# Altium schematic sheet PDB_v1.SchDoc
size 260 x 327 mm; Origin: Eagle
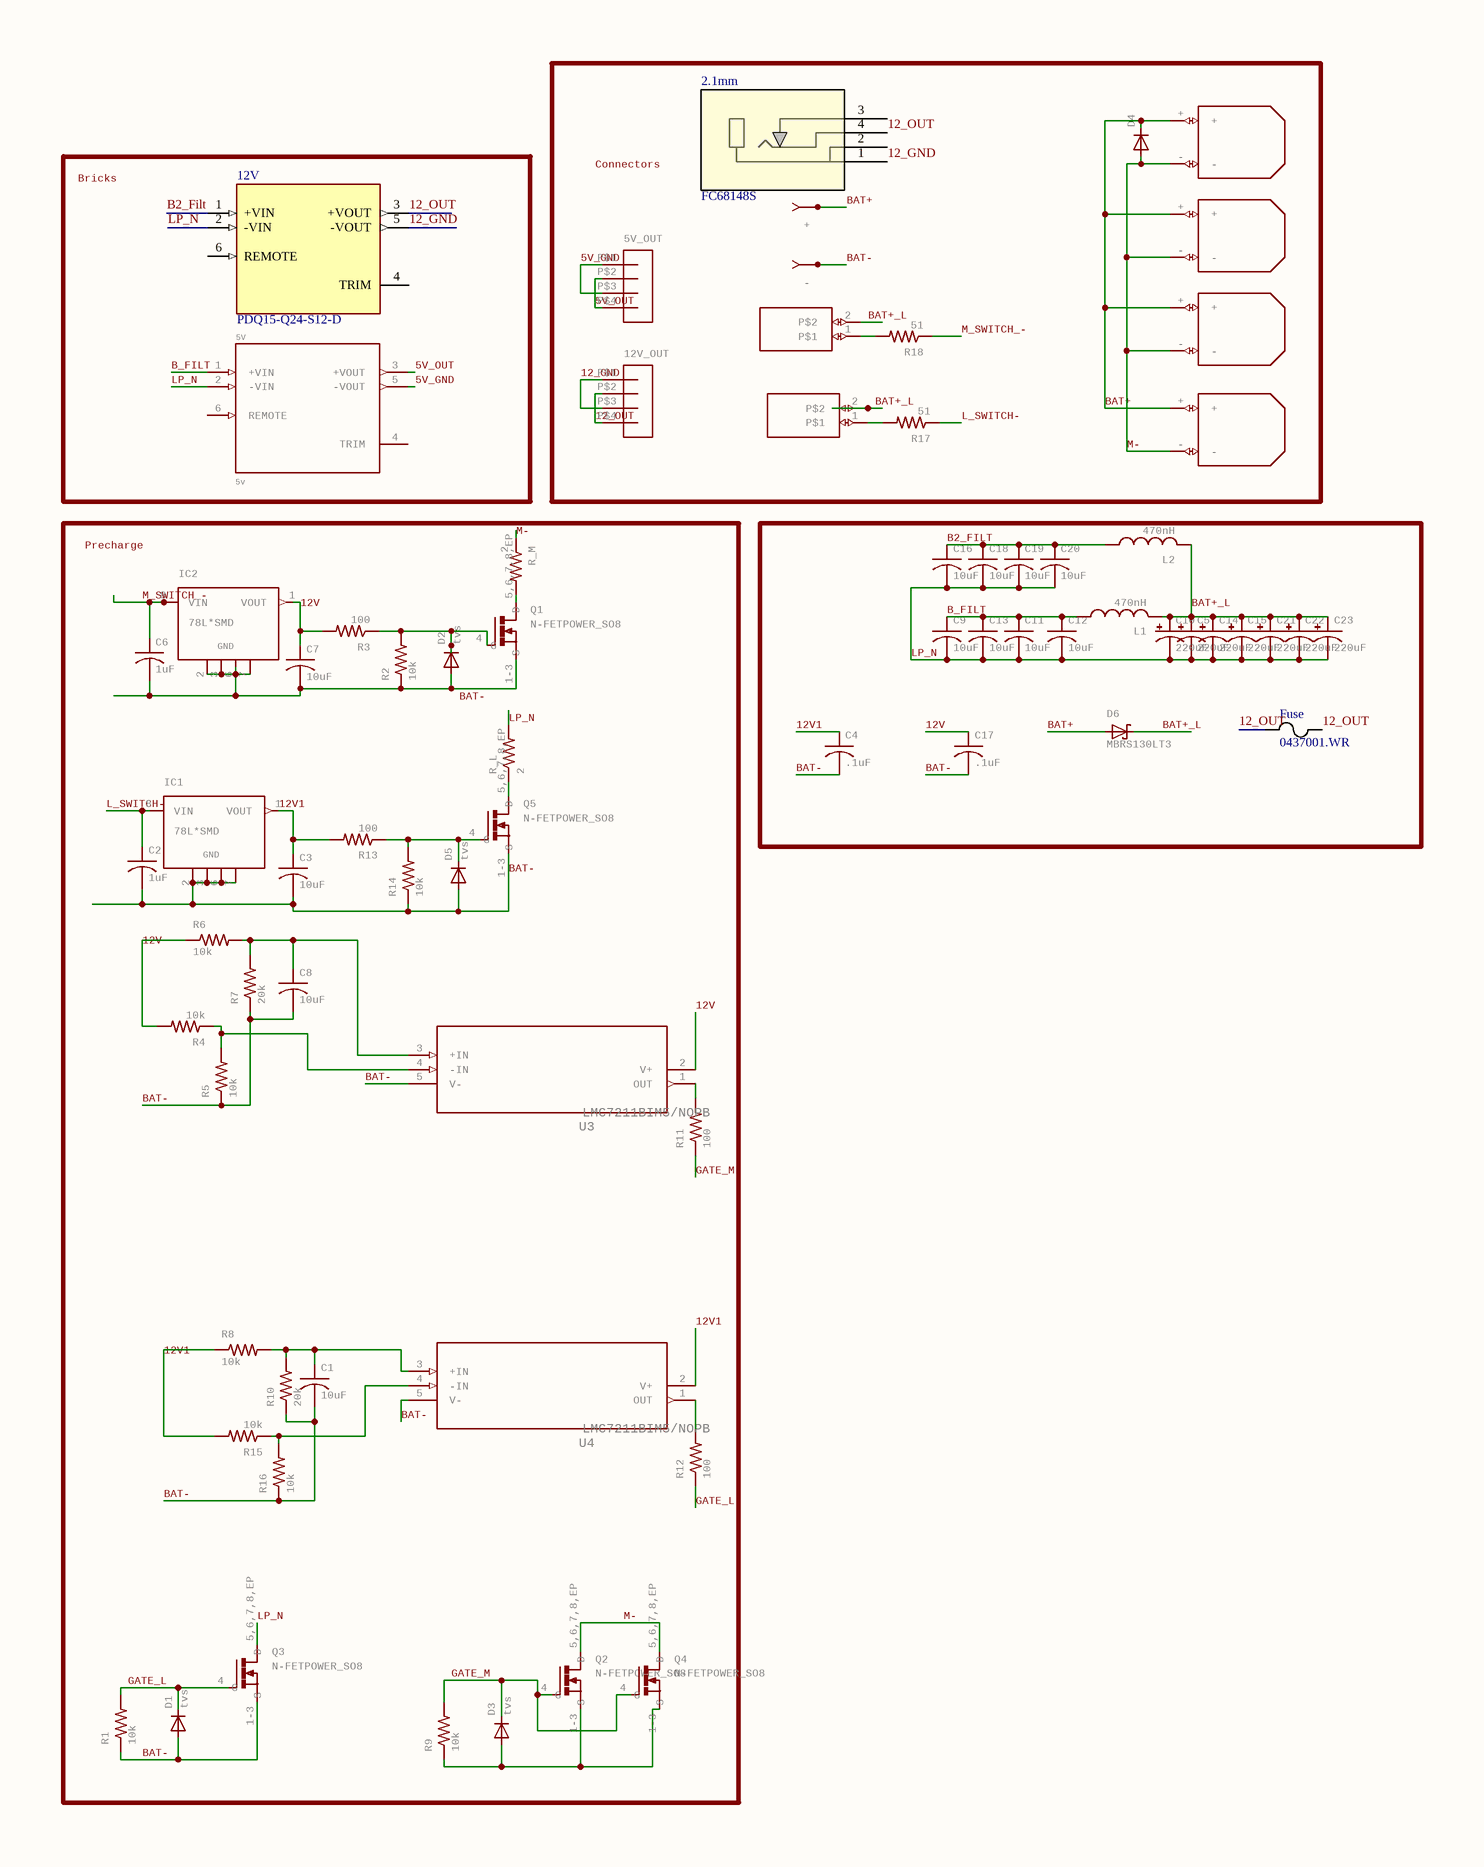
[diagram p0: PDB_v1.SchDoc]

## Parts
2.1mm  FC68148S  [FC68148S_CLF]
5V  5v  [CONV_PDQ30-Q24-S5-D]
5V_OUT  HEADER_POS4_?43045-0401  [43045-0400]  (value not drawn)
12V  PDQ15-Q24-S12-D  [CONV_PDQ15-Q24-S12-D]
12V_OUT  HEADER_POS4_?43045-0401  [43045-0400]  (value not drawn)
+  QFIT  [FASTON]  (value not drawn)
-  QFIT  [FASTON]  (value not drawn)
C1  10uF  [C0603K]
C2  1uF  [C0603K]
C3  10uF  [C0603K]
C4  .1uF  [C0603K]
C5  220uF  [E3,5-8]
C6  1uF  [C0603K]
C7  10uF  [C0603K]
C8  10uF  [C0603K]
C9  10uF  [C1206K]
C10  220uF  [E3,5-8]
C11  10uF  [C1206K]
C12  10uF  [C1206K]
C13  10uF  [C1206K]
C14  220uF  [E3,5-8]
C15  220uF  [E3,5-8]
C16  10uF  [C1206K]
C17  .1uF  [C0603K]
C18  10uF  [C1206K]
C19  10uF  [C1206K]
C20  10uF  [C1206K]
C21  220uF  [E3,5-8]
C22  220uF  [E3,5-8]
C23  220uF  [E3,5-8]
D1  tvs  [DO214AC]
D2  tvs  [DO214AC]
D3  tvs  [DO214AC]
D4  DIODE-SMB  [SMB]  (value not drawn)
D5  tvs  [DO214AC]
D6  MBRS130LT3  [SMB]
Fuse  0437001.WR  [0437Series_LTF]
IC1  78L*SMD  [SO08]
IC2  78L*SMD  [SO08]
L1  470nH  [L3225P]
L2  470nH  [L3225P]
Q1  N-FETPOWER_SO8  [TRANS_TPH5900CNH,L1Q]
Q2  N-FETPOWER_SO8  [TRANS_TPH5900CNH,L1Q]
Q3  N-FETPOWER_SO8  [TRANS_TPH5900CNH,L1Q]
Q4  N-FETPOWER_SO8  [TRANS_TPH5900CNH,L1Q]
Q5  N-FETPOWER_SO8  [TRANS_TPH5900CNH,L1Q]
R1  10k  [R0402]
R2  10k  [R0402]
R3  100  [R0402]
R4  10k  [R0402]
R5  10k  [R0402]
R6  10k  [R0402]
R7  20k  [R0402]
R8  10k  [R0402]
R9  10k  [R0402]
R10  20k  [R0402]
R11  100  [R0402]
R12  100  [R0402]
R13  100  [R0402]
R14  10k  [R0402]
R15  10k  [R0402]
R16  10k  [R0402]
R17  51  [R0603]
R18  51  [R0603]
R_L  2  [D2PAK]
R_M  2  [D2PAK]
U3  LMC7211BIM5/NOPB  [MF05A]
U4  LMC7211BIM5/NOPB  [MF05A]
U$3  XT30FEMALW  [XT30_H_F]  (value not drawn)
U$8  XT30FEMALW  [XT30_H_F]  (value not drawn)
U$9  XT30FEMALW  [XT30_H_F]  (value not drawn)
U$10  XT30FEMALW  [XT30_H_F]  (value not drawn)
U$13  2-PINM80_H  [M80-840242]  (value not drawn)
U$14  2-PINM80_H  [M80-840242]  (value not drawn)

## Blocks framed on the sheet
Connectors: 2.1mm 5V_OUT 12V_OUT + - D4 R17 R18 U$3 U$8-U$10 U$13 U$14
Bricks: 5V 12V
Precharge: C1-C3 C6-C8 D1-D3 D5 IC1 IC2 Q1-Q5 R1-R16 R_L R_M U3 U4

## Nets
5V_GND: 5V.5(-VOUT) 5V_OUT.P$1 5V_OUT.P$3
5V_OUT: 5V.3(+VOUT) 5V_OUT.P$2 5V_OUT.P$4
12_GND: 2.1mm.1 12V.5(-VOUT) 12V_OUT.P$1 12V_OUT.P$3
12_OUT: 2.1mm.4 12V.3(+VOUT) 12V_OUT.P$2 12V_OUT.P$4 Fuse.1 Fuse.2
12V: C7.1 C17.1 IC2.1(VOUT) R3.2 R4.2 R6.1 U3.2(V+)
12V1: C3.1 C4.1 IC1.1(VOUT) R8.1 R13.2 R15.2 U4.2(V+)
B2_FILT: 12V.1(+VIN) C16.1 C18.1 C19.1 C20.1 L2.1
B_FILT: 5V.1(+VIN) C9.1 C11.1 C12.1 C13.1 L1.1
BAT+: +.1 +.2 D4.C D6.A U$3.+ U$8.+ U$9.+ U$10.+
BAT+_L: C5.+ C10.+ C14.+ C15.+ C21.+ C22.+ C23.+ D6.C L1.2 L2.2 U$13.2(P$2) U$14.2(P$2)
BAT-: -.1 -.2 C1.2 C2.2 C3.2 C4.2 C6.2 C7.2 C8.2 C17.2 D1.A D2.A D5.A IC1.2(GND) IC1.3(GND) IC1.6(GND) IC1.7(GND) IC2.2(GND) IC2.3(GND) IC2.6(GND) IC2.7(GND) Q1.1-3(S) Q3.1-3(S) Q5.1-3(S) R1.1 R2.1 R5.1 R7.1 R10.1 R14.1 R16.1 U3.5(V-) U4.5(V-)
GATE_L: D1.C Q3.4(G) R1.2 R12.1
GATE_M: D3.C Q2.4(G) Q4.4(G) R9.2 R11.1
L_SWITCH-: C2.1 IC1.8(VIN) R17.1
LP_N: 5V.2(-VIN) 12V.2(-VIN) C5.- C9.2 C10.- C11.2 C12.2 C13.2 C14.- C15.- C16.2 C18.2 C19.2 C20.2 C21.- C22.- C23.- Q3.5,6,7,8,EP(D) R_L.3
M-: D4.A Q2.5,6,7,8,EP(D) Q4.5,6,7,8,EP(D) R_M.1 U$3.- U$8.- U$9.- U$10.-
M_SWITCH_-: C6.1 IC2.8(VIN) R18.1
NetC1_1: C1.1 R8.2 R10.2 U4.3(+IN)
NetC8_1: C8.1 R6.2 R7.2 U3.3(+IN)
NetD2_C: D2.C Q1.4(G) R2.2 R3.1
NetD3_A: D3.A Q2.1-3(S) Q4.1-3(S) R9.1
NetD5_C: D5.C Q5.4(G) R13.1 R14.2
NetQ1_5,6,7,8,EP: Q1.5,6,7,8,EP(D) R_M.3
NetQ5_5,6,7,8,EP: Q5.5,6,7,8,EP(D) R_L.1
NetR4_1: R4.1 R5.2 U3.4(-IN)
NetR11_2: R11.2 U3.1(OUT)
NetR12_2: R12.2 U4.1(OUT)
NetR15_1: R15.1 R16.2 U4.4(-IN)
NetR17_2: R17.2 U$14.1(P$1)
NetR18_2: R18.2 U$13.1(P$1)

Not connected (* = marked no-connect by the designer): 2.1mm 2 3; 5V 4(TRIM) 6(REMOTE); 12V 4(TRIM) 6(REMOTE)

## Library data of the parts
2.1mm = FC68148S: No Description Available; Manufacturer_Name: Cliff; Copyright: Copyright (C) 2025 Ultra Librarian. All rights reserved.; Manufacturer_Part_Number: FC68148S; RefDes: RefDes; Type: Type
5V = PDQ30-Q24-S5-D: 12 Vdc, 2.5 A, 30 W, 9 ~ 36 Vdc; GateName_1: G$1; MF: CUI; SymbolName_1: PDQ30-Q24-S5-D; LibraryName: PDQ30-Q24-S5-D; DeviceSetName: PDQ30-Q24-S5-D; CUI_PURCHASE_URL: https://www.cui.com/product/power/dc-dc-converters/isolated/pdq30-d-series?utm_source=snapeda.com&utm_medium=referral&utm_campaign=snapedaBOM; DIGI-KEY_PART_NUMBER: 102-3891-ND; DIGI-KEY_PURCHASE_URL: https://www.digikey.com/product-detail/en/cui-inc/PDQ30-Q24-S5-D/102-3891-ND/6165424?utm_source=snapeda&utm_medium=aggregator&utm_campaign=symbol; MP: PDQ30-Q24-S5-D; PACKAGE: DIP-6 CUI
5V_OUT 12V_OUT = HEADER_POS4_?43045-0401: Molex - Micro-Fit 3.0 Series connector,  3.00mm (0.118") pitch header, 4 positions.; GateName_1: G$1; SymbolName_1: HEADER_POS4; DeviceName: 43045-0401; LibraryName: con-molex-micro-fit-3_0; DeviceSetName: HEADER_POS4_?; MATERIAL: MATERIAL
12V = PDQ15-Q24-S12-D: 12 Vdc, 1.250 A, 15 W, 9 ~ 36 Vdc; MF: {'manufacturer': u'CUI'}; MP: PDQ15-Q24-S12-D; Price: None; Availability: Unavailable; Value: *; Package: None
+ - = QFIT: QUICKFIT PCB TERMINAL; GateName_1: G$1; SymbolName_1: QFIT-2; LibraryName: keystone; DeviceSetName: QFIT
C1-C4 C6-C8 C17 = C-USC0603K: CAPACITOR, American symbol; GateName_1: G$1; SymbolName_1: C-US; DeviceName: C0603K; LibraryName: rcl; DeviceSetName: C-US
C5 C10 C14 C15 C21-C23 = CPOL-USE3.5-8: POLARIZED CAPACITOR, American symbol; GateName_1: G$1; DeviceName: E3.5-8; SymbolName_1: CPOL-US; LibraryName: rcl; DeviceSetName: CPOL-US
C9 C11-C13 C16 C18-C20 = C-USC1206K: CAPACITOR, American symbol; GateName_1: G$1; SymbolName_1: C-US; DeviceName: C1206K; LibraryName: rcl; DeviceSetName: C-US
D1-D3 D5 = DIODE-DO214AC: DIODE; GateName_1: G$1; SymbolName_1: D; DeviceSetName: DIODE-; DeviceName: DO214AC; LibraryName: diode
D4 = DIODE-SMB: DIODE; GateName_1: G$1; SymbolName_1: D; DeviceSetName: DIODE-; DeviceName: SMB; LibraryName: diode
D6 = MBRS130LT3: Schottky Power Rectifier   Source: http://www.onsemi.com/pub/Collateral/MBRS130LT3-D.PDF; GateName_1: G$1; SymbolName_1: SCHOTTKY; LibraryName: diode; DeviceSetName: MBRS130LT3
Fuse = 0437001.WR: No Description Available; Manufacturer_Name: Littelfuse Inc; Copyright: Copyright (C) 2025 Ultra Librarian. All rights reserved.; Manufacturer_Part_Number: 0437001.WR
IC1 IC2 = 78L*SMD: Positive VOLTAGE REGULATOR; GateName_1: G$1; SymbolName_1: LM78LXX; LibraryName: linear; DeviceSetName: 78L*SMD; GND: GND
L1 L2 = L-USL3225P: INDUCTOR, American symbol; GateName_1: G$1; SymbolName_1: L-US; DeviceName: L3225P; LibraryName: rcl; DeviceSetName: L-US
Q1-Q5 = N-FETPOWER_SO8: N-CHANNEL MOS FET SYMBOL; GateName_1: G$1; SymbolName_1: MFN-D; DeviceSetName: N-FET; DeviceName: POWER_SO8; LibraryName: Ben_Library
R1-R16 = R-US_R0402: RESISTOR, American symbol; GateName_1: G$1; SymbolName_1: R-US; DeviceSetName: R-US_; DeviceName: R0402; LibraryName: rcl
R17 R18 = R-US_R0603: RESISTOR, American symbol; GateName_1: G$1; SymbolName_1: R-US; DeviceSetName: R-US_; DeviceName: R0603; LibraryName: rcl
R_L R_M = RESISTOR: GateName_1: G$1; SymbolName_1: R-US; LibraryName: BenLibrary; DeviceSetName: RESISTOR
U3 U4 = LMC7211BIM5/NOPB: MANUFACTURER_PART_NUMBER: LMC7211BIM5NOPB; GateName_1: A; VENDOR: Texas Instruments; SymbolName_1: LMC7211BIM5/NOPB; LibraryName: lmc7211; DeviceSetName: LMC7211BIM5/NOPB
U$3 U$8-U$10 = XT30FEMALW: GateName_1: G$1; SymbolName_1: XT30; DeviceName: FEMALW; LibraryName: Ben_Library; DeviceSetName: XT30
U$13 U$14 = 2-PINM80_H: GateName_1: G$1; SymbolName_1: 2-PIN; DeviceName: M80_H; LibraryName: Ben_Library; DeviceSetName: 2-PIN